# Altium project Bluetooth_BLUE.PrjPCB
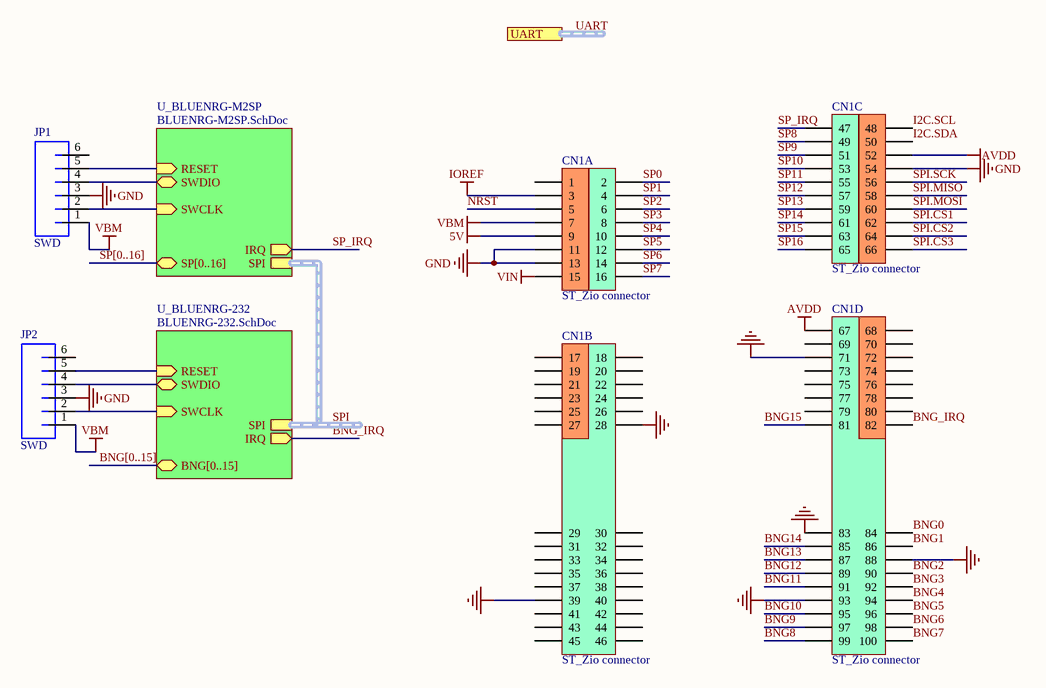
[diagram p0: Bluetooth_BLUE.SchDoc]
4 sheets, 72 parts. Net scope: hierarchical (ports join the sheet entries above them; power ports are global).
Board file: Bluetooth_BLUE.PcbDoc
Sheets:
  Bluetooth_BLUE.SchDoc
    U_BLUENRG-M2SP = BLUENRG-M2SP.SchDoc
    U_BLUENRG-232 = BLUENRG-232.SchDoc
  STM32WB.SchDoc

## Sheet Bluetooth_BLUE.SchDoc
size A4

### Parts
CN1  ST_Zio connector  [ST_Zio]  (parts A,B,C,D of 4)
JP1  SWD  [MOLEX_5045_6]
JP2  SWD  [MOLEX_5045_6]

### Sub-sheets
U_BLUENRG-232 = BLUENRG-232.SchDoc: BNG[0..15] (bidir), IRQ (out), RESET (in), SWCLK (in), SWDIO (bidir), SPI (harness SPI)
U_BLUENRG-M2SP = BLUENRG-M2SP.SchDoc: IRQ (out), RESET (in), SWCLK (in), SWDIO (bidir), SPI (harness SPI), SP[0..16] (bidir)

### Ports
UART (harness USART2)

### Nets
5V: CN1.9
AVDD: CN1.52 CN1.67
GND: CN1.11 CN1.13 CN1.28 CN1.39 CN1.54 CN1.71 CN1.83 CN1.88 CN1.93 JP1.3 JP2.3
IOREF: CN1.3
VBM: CN1.7 JP1.1 JP2.1
VIN: CN1.15
BNG0: CN1.84
BNG1: CN1.86
BNG2: CN1.90
BNG3: CN1.92
BNG4: CN1.94
BNG5: CN1.96
BNG6: CN1.98
BNG7: CN1.82 CN1.100 ; sheet U_BLUENRG-232/IRQ  [also labelled BNG_IRQ]
BNG8: CN1.99
BNG9: CN1.97 JP2.2 ; sheet U_BLUENRG-232/SWCLK
BNG10: CN1.95 JP2.4 ; sheet U_BLUENRG-232/SWDIO
BNG11: CN1.91
BNG12: CN1.89
BNG13: CN1.87
BNG14: CN1.85
BNG15: CN1.81
I2C.SCL: CN1.48
I2C.SDA: CN1.50
NRST: CN1.5
SP0: CN1.2
SP1: CN1.4
SP2: CN1.6
SP3: CN1.8
SP4: CN1.10
SP5: CN1.12
SP6: CN1.14
SP7: CN1.16
SP8: CN1.49
SP9: CN1.51 JP1.2 ; sheet U_BLUENRG-M2SP/SWCLK
SP10: CN1.53 JP1.4 ; sheet U_BLUENRG-M2SP/SWDIO
SP11: CN1.55
SP12: CN1.57
SP13: CN1.59
SP14: CN1.61
SP15: CN1.63
SP16: CN1.65
SP_IRQ: CN1.47 ; sheet U_BLUENRG-M2SP/IRQ
SPI.CS1: CN1.62
SPI.CS2: CN1.64
SPI.CS3: CN1.66
SPI.MISO: CN1.58
SPI.MOSI: CN1.60
SPI.SCK: CN1.56
NetCM2_1: JP1.5 ; sheet U_BLUENRG-M2SP/RESET
NetJP2_5: JP2.5 ; sheet U_BLUENRG-232/RESET

Not connected (* = marked no-connect by the designer): CN1 1 17 18 19 20 21 22 23 24 25 26 27 29 30 31 32 33 34 35 36 37 38 40 41 42 43 44 45 46 68 69 70 72 73 74 75 76 77 78 79 80; JP1 6; JP2 6

### Buses and harness runs
bus BNG[0..15] = sheet U_BLUENRG-232/BNG[0..15]
bus SP[0..16] = sheet U_BLUENRG-M2SP/SP[0..16]
harness SPI = sheet U_BLUENRG-232/SPI = sheet U_BLUENRG-M2SP/SPI
harness UART = port UART

### Library data of the parts
JP1 JP2 = MOLEX_5045_6: PartNumber: B6B-PH-K-S(LF)(SN); Manufacturer: JST Sales America Inc.; PackageReference: JST-PH; Mounting Technology: Through Hole

## Sheet BLUENRG-M2SP.SchDoc
size A4
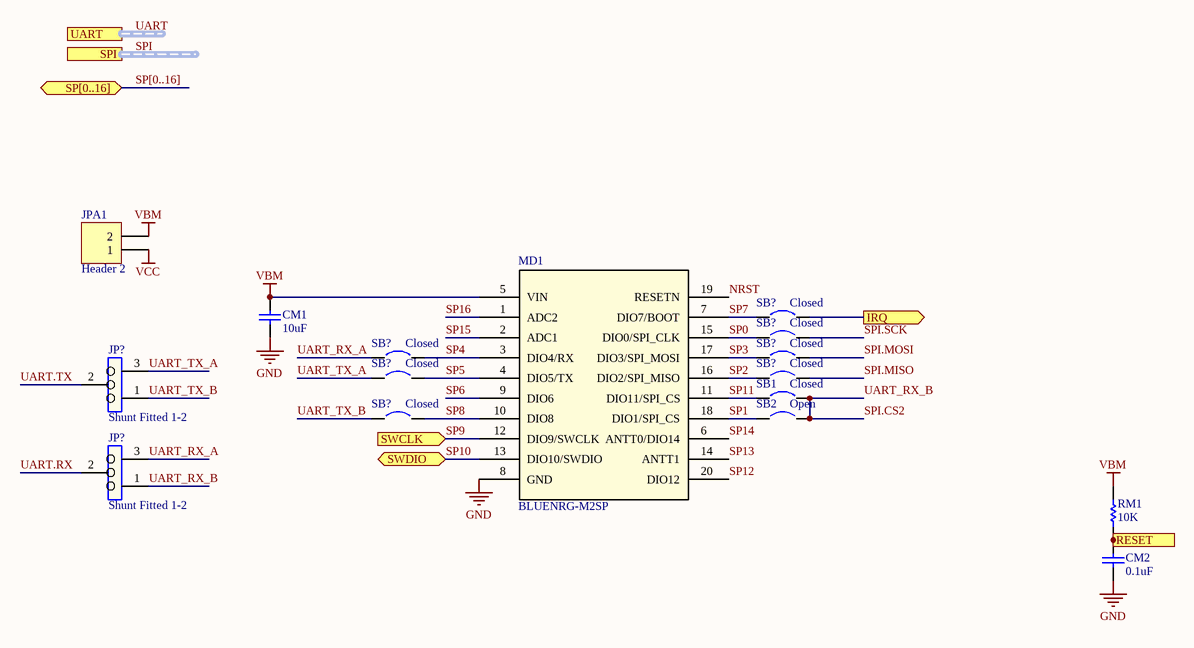
[diagram p1: BLUENRG-M2SP.SchDoc]

### Parts
(Parts that share a designator on the sheet are numbered #1, #2 ... from top to bottom, then left to right.)
CM1  value 10uF  [C0603[1608X92]]  (hidden comment: 10uF 6.3V 0603)
CM2  value 0.1uF  [C0603[1608X92]]  (hidden comment: 0.1uF 16V 0603)
JP?#1  value Shunt Fitted 1-2  [HDR1X3]  (hidden comment: Jumper_Header 3x1 Fitted 1-2)
JP?#2  value Shunt Fitted 1-2  [HDR1X3]  (hidden comment: Jumper_Header 3x1 Fitted 1-2)
JPA1  Header 2  [HDR1X2]
MD1  BLUENRG-M2SP  [BLUENRG-M2SP]
RM1  value 10K  [R0603[1608]]  (hidden comment: 10K 1% 0603)
SB1  Closed  [SB_0603]
SB2  Open  [SB_0603]
SB?#1  Closed  [SB_0603]
SB?#2  Closed  [SB_0603]
SB?#3  Closed  [SB_0603]
SB?#4  Closed  [SB_0603]
SB?#5  Closed  [SB_0603]
SB?#6  Closed  [SB_0603]
SB?#7  Closed  [SB_0603]

### Ports
IRQ (out), RESET (in), SP[0..16] (bidir), SPI (harness SPI), SWCLK (in), SWDIO (bidir), UART (harness USART2)

### Nets
GND: CM1.2 CM2.2 MD1.8(GND)
VBM: CM1.1 JPA1.2 MD1.5(VIN) RM1.2
VCC: JPA1.1
NRST: MD1.19(RESETN)
SP0: MD1.15(DIO0/SPI_CLK) SB?#2.1
SP1: MD1.18(DIO1/SPI_CS) SB2.1
SP2: MD1.16(DIO2/SPI_MISO) SB?#6.1
SP3: MD1.17(DIO3/SPI_MOSI) SB?#4.1
SP4: MD1.3(DIO4/RX) SB?#3.2
SP5: MD1.4(DIO5/TX) SB?#5.2
SP6: MD1.9(DIO6)
SP7: MD1.7(DIO7/BOOT) SB?#1.1
SP8: MD1.10(DIO8) SB?#7.2
SP9: MD1.12(DIO9/SWCLK) ; port SWCLK
SP10: MD1.13(DIO10/SWDIO) ; port SWDIO
SP11: MD1.11(DIO11/SPI_CS) SB1.1
SP12: MD1.20(DIO12)
SP13: MD1.14(ANTT1)
SP14: MD1.6(ANTT0/DIO14)
SP15: MD1.2(ADC1)
SP16: MD1.1(ADC2)
SP_IRQ: SB?#1.2 ; port IRQ
SPI.CS2: JP?#2.1 SB1.2 SB2.2  [also labelled UART_RX_B]
SPI.MISO: SB?#6.2
SPI.MOSI: SB?#4.2
SPI.SCK: SB?#2.2
UART.RX: JP?#2.2
UART.TX: JP?#1.2
UART_RX_A: JP?#2.3 SB?#3.1
UART_TX_A: JP?#1.3 SB?#5.1
UART_TX_B: JP?#1.1 SB?#7.1
NetCM2_1: CM2.1 RM1.1 ; port RESET

### Buses and harness runs
bus SP[0..16] = port SP[0..16]
harness SPI = port SPI
harness UART = port UART

### Library data of the parts
CM1 = CAP_10uF_6.3V_0603_10%: 10uF 6.3V 10% 0603 (1608 Metric); PartNumber: GRM188R60J106KE47D; Manufacturer: Murata; TemperatureCoefficient: X5R; Mounting Technology: Surface Mount; PackageReference: 0603; PackageDescription: 0603 (1608 Metric); Voltage: 6.3V; Tolerance: 10%
CM2 = CAP_0.1uF_16V_0603_10%: 0.1uF 16V 10% 0603 (1608 Metric); PartNumber: GCM188R71C104KA37D; Manufacturer: Murata; TemperatureCoefficient: X7R; Mounting Technology: Surface Mount; PackageReference: 0603; PackageDescription: 0603 (1608 Metric); Voltage: 16V; Tolerance: 10%
JP?#1 JP?#2 = Jumper_Header 3x1 Fitted 1-2: Header, 3x1, 2,54mm, VR, TH, Height 5.84mm/2.54mm - Shunt Fitted 1-2 by default; Internal_Part_Number: MCD-00684; Part_Type: Connector; Manufacturer_Part_Number: TSW-103-07-F-S; Manufacturer: SAMTEC; Provided_By: SUBCO; Status: Released; ComponentLink1Description: Datasheet; ComponentLink1URL: http://tunmcdsvn.tun.st.com/Component_Datasheet_Library/Trunk/Connectors/Samtec_TSW-HTSW-series; ECCN_US: n/a; ECCN_EU: n/a
JPA1 = Header 2: Header, 2-Pin; LatestRevisionDate: 17-Jul-2002; LatestRevisionNote: Re-released for DXP Platform.; Publisher: Altium Limited
MD1 = BLUENRG-M2SP: Manufacturer: STMicroelectronics; PartNumber: BLUENRG-M2SP
RM1 = RES_10K_0603_1%: 10K 0.25W 1% 0603 (1005 Metric); Manufacturer: Vishay / Dale; PartNumber: CRCW060310K0FKEAHP; Tolerance: 1%; Power: 0.25W; Mounting Technology: Surface Mount; PackageReference: 0603; PackageDescription: 0603 (1608 Metric); ComponentLink1Description: Datasheet; ComponentLink1URL: http://www.vishay.com/docs/20065/rcse3.pdf
SB1 SB?#1-SB?#7 = Circuit Breaker_close: Circuit Breaker; Published: 24-Mar-1999; Revision: July-2002: Re-released for DXP Platform.; Publisher: Altium Limited
SB2 = Circuit Breaker: Published: 24-Mar-1999; Revision: July-2002: Re-released for DXP Platform.; Publisher: Altium Limited

## Sheet BLUENRG-232.SchDoc
size A4
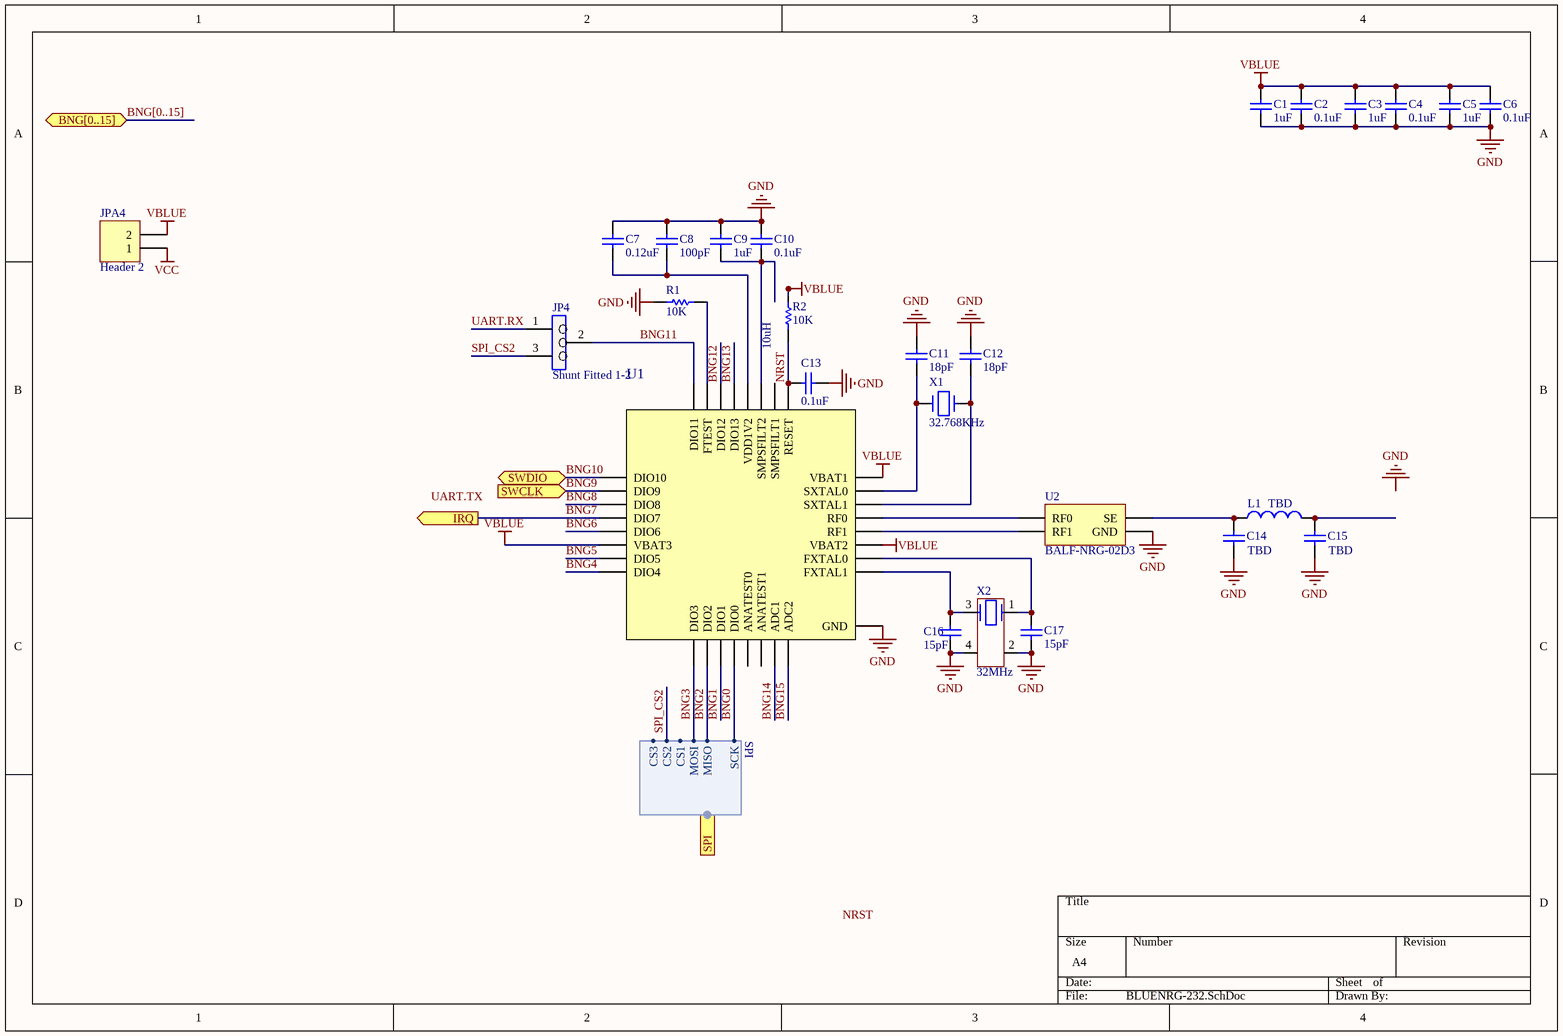
[diagram p2: BLUENRG-232.SchDoc]

### Parts
(Parts that share a designator on the sheet are numbered #1, #2 ... from top to bottom, then left to right.)
C1#1  value 1uF  [C0603[1608X92]]  (hidden comment: 1uF 6.3V 0603)
C2#1  value 0.1uF  [C0603[1608X92]]  (hidden comment: 0.1uF 6.3V 0603)
C3#1  value 1uF  [C0603[1608X92]]  (hidden comment: 1uF 6.3V 0603)
C4#1  value 0.1uF  [C0603[1608X92]]  (hidden comment: 0.1uF 6.3V 0603)
C5#1  value 1uF  [C0603[1608X92]]  (hidden comment: 1uF 6.3V 0603)
C6#1  value 0.1uF  [C0603[1608X92]]  (hidden comment: 0.1uF 6.3V 0603)
C7#1  value 0.12uF  [C0603[1608X92]]  (hidden comment: 0.12uF 10V 0603)
C8#1  value 100pF  [C0603[1608X92]]  (hidden comment: 100pF 10V 0603)
C9#1  value 1uF  [C0603[1608X92]]  (hidden comment: 1uF 6.3V 0603)
C10#1  value 0.1uF  [C0603[1608X92]]  (hidden comment: 0.1uF 6.3V 0603)
C11#1  value 18pF  [C0603[1608X92]]  (hidden comment: 18pF 50V 0603)
C12#1  value 18pF  [C0603[1608X92]]  (hidden comment: 18pF 50V 0603)
C13#1  value 0.1uF  [C0603[1608X92]]  (hidden comment: 0.1uF 16V 0603)
C14#1  CAPACITOR 0603  [C0603[1608X92]]  (value not drawn)
C15#1  CAPACITOR 0603  [C0603[1608X92]]  (value not drawn)
C16#1  value 15pF  [C0603[1608X92]]  (hidden comment: 15pF 50V 0603)
C17#1  value 15pF  [C0603[1608X92]]  (hidden comment: 15pF 50V 0603)
JP4#1  value Shunt Fitted 1-2  [HDR1X3]  (hidden comment: Jumper_Header 3x1 Fitted 1-2)
JPA4#1  Header 2  [HDR1X2]
L1#1  INDUCTOR 0603  [IND0603]  (value not drawn)
R1#1  value 10K  [R0603[1608]]  (hidden comment: 10K 1% 0603)
R2#1  value 10K  [R0603[1608]]  (hidden comment: 10K 1% 0603)
U1  BLUENRG-232  [QFPN-32-5x5mm]  (value not drawn)
U2#1  BALF-NRG-02D3  [CSPG-4 (0.4mm)]
X1#1  value 32.768KHz  [2-SMD]  (hidden comment: NX3215SA 32.768KHz)
X2#1  value 32MHz  [4-SMD]  (hidden comment: NX2016SA 32MHz)

### Ports
BNG[0..15] (bidir), IRQ (out), SPI (harness SPI), SWCLK (in), SWDIO (bidir)

### Harnesses
SPI: MOSI, MISO, SCK, CS1, CS2, CS3

### Nets
GND: C1#1.1 C2#1.1 C3#1.1 C4#1.1 C5#1.1 C6#1.1 C7#1.2 C8#1.2 C9#1.2 C10#1.2 C11#1.2 C12#1.2 C13#1.2 C14#1.1 C15#1.1 C16#1.1 C17#1.1 R1#1.2 U1.33(GND) U2#1.A2(GND) X2#1.2 X2#1.4
VBLUE: C1#1.2 C2#1.2 C3#1.2 C4#1.2 C5#1.2 C6#1.2 JPA4#1.2 R2#1.2 U1.6(VBAT3) U1.19(VBAT2) U1.24(VBAT1)
VCC: JPA4#1.1
BNG0: U1.12(DIO0) ; port SPI.SCK
BNG1: U1.11(DIO1)
BNG2: U1.10(DIO2) ; port SPI.MISO
BNG3: U1.9(DIO3) ; port SPI.MOSI
BNG4: U1.8(DIO4)
BNG5: U1.7(DIO5)
BNG6: U1.5(DIO6)
BNG7: U1.4(DIO7) ; port IRQ
BNG8: U1.3(DIO8)
BNG9: U1.2(DIO9) ; port SWCLK
BNG10: U1.1(DIO10) ; port SWDIO
BNG11: JP4#1.2 U1.32(DIO11)
BNG12: U1.30(DIO12)
BNG13: U1.29(DIO13)
BNG14: U1.15(ADC1)
BNG15: U1.16(ADC2)
NRST: C13#1.1 R2#1.1 U1.25(RESET)
SPI_CS2: JP4#1.3 ; port SPI.CS2  [project net SPI.CS2]
UART.RX: JP4#1.1
NetC7#1_1: C7#1.1 C8#1.1 U1.28(VDD1V2)
NetC9#1_1: C9#1.1 C10#1.1 U1.27(SMPSFILT2)
NetC11#1_1: C11#1.1 U1.23(SXTAL0) X1#1.1(X1)
NetC12#1_1: C12#1.1 U1.22(SXTAL1) X1#1.2(X2)
NetC14#1_2: C14#1.2 L1#1.1 U2#1.A1(SE)
NetC15#1_2: C15#1.2 L1#1.2
NetC16#1_2: C16#1.2 U1.17(FXTAL1) X2#1.3
NetC17#1_2: C17#1.2 U1.18(FXTAL0) X2#1.1
NetR1#1_1: R1#1.1 U1.31(FTEST)
NetU1_20: U1.20(RF1) U2#1.B2(RF1)
NetU1_21: U1.21(RF0) U2#1.B1(RF0)

Not connected (* = marked no-connect by the designer): U1 13(ANATEST0) 14(ANATEST1) 26(SMPSFILT1)

### Buses and harness runs
bus BNG[0..15] = port BNG[0..15]

### Notes on the sheet
- (near R2#1) 10uH
- (near L1#1) TBD
- (near C14#1) TBD
- (near C15#1) TBD
- Labels drawn without touching a wire or pin: GND, NRST, UART.TX

### Library data of the parts
C1#1 C3#1 C5#1 C9#1 = CAP_1uF_6.3V_0603_10%: 1uF 6.3V 10% 0603 (1608 Metric); PartNumber: GRM188R60J105KA01D; Manufacturer: Murata; TemperatureCoefficient: X5R; Mounting Technology: Surface Mount; PackageReference: 0603; PackageDescription: 0603 (1608 Metric); Voltage: 6.3V; Tolerance: 10%
C2#1 C4#1 C6#1 C10#1 = CAP_0.1uF_6.3V_0603_10%: 0.1uF 6.3V 10% 0603 (1608 Metric); PartNumber: GRM188R70J104KA01D; Manufacturer: Murata; Mounting Technology: Surface Mount; PackageReference: 0603; PackageDescription: 0603 (1608 Metric); Voltage: 6.3V; Tolerance: 10%
C7#1 = CAP_0.12uF_10V_0603_10%: 0.12uF 10V 10% 0603 (1608 Metric); PartNumber: GRM188R71A124KA01D; Manufacturer: Murata; TemperatureCoefficient: X7R; Mounting Technology: Surface Mount; PackageReference: 0603; PackageDescription: 0603 (1608 Metric); Voltage: 10V; Tolerance: 10%
C8#1 = CAP_100pF_10V_0603_10%: 100pF 10V 10% 0603 (1608 Metric); PartNumber: 885012206003; Manufacturer: Wurth; TemperatureCoefficient: X7R; Mounting Technology: Surface Mount; PackageReference: 0603; PackageDescription: 0603 (1608 Metric); Voltage: 10V; Tolerance: 10%
C11#1 C12#1 = CAP_18pF_50V_0603_1%: 18pF 50V 1% 0603 (1608 Metric); PartNumber: 06035A180FAT2A; Manufacturer: AVX Corporation; TemperatureCoefficient: C0G; Mounting Technology: Surface Mount; PackageReference: 0603; PackageDescription: 0603 (1608 Metric); Voltage: 50V; Tolerance: 1%
C13#1 = CAP_0.1uF_16V_0603_10%: as CM2 on sheet BLUENRG-M2SP; Mounting Technology: Surface Mount; PackageReference: 0603; PackageDescription: 0603 (1608 Metric); Voltage: 16V; Tolerance: 10%
C14#1 C15#1 = CAP 0603: Empty CAPACITOR 0603 (1608 Metric); Mounting Technology: Surface Mount; PackageReference: 0603; PackageDescription: 0603 (1608 Metric)
C16#1 C17#1 = CAP_15pF_50V_0603_1%: 15pF 50V 1% 0603 (1608 Metric); PartNumber: 06035A150FAT2A; Manufacturer: AVX Corporation; TemperatureCoefficient: C0G; Mounting Technology: Surface Mount; PackageReference: 0603; PackageDescription: 0603 (1608 Metric); Voltage: 50V; Tolerance: 1%
JP4#1 = Jumper_Header 3x1 Fitted 1-2: as JP?#1 on sheet BLUENRG-M2SP; Status: Released; ComponentLink1Description: Datasheet; ComponentLink1URL: http://tunmcdsvn.tun.st.com/Component_Datasheet_Library/Trunk/Connectors/Samtec_TSW-HTSW-series; ECCN_US: n/a; ECCN_EU: n/a
JPA4#1 = Header 2: Header, 2-Pin; LatestRevisionDate: 17-Jul-2002; LatestRevisionNote: Re-released for DXP Platform.; Publisher: Altium Limited
L1#1 = IND 0603: Empty INDUCTOR 0603; PackageReference: 0603; PackageDescription: 0603 (1608 metric); Mounting Technology: Surface Mount
R1#1 R2#1 = RES_10K_0603_1%: as RM1 on sheet BLUENRG-M2SP; Tolerance: 1%; Power: 0.25W; Mounting Technology: Surface Mount; PackageReference: 0603; PackageDescription: 0603 (1608 Metric); ComponentLink1Description: Datasheet; ComponentLink1URL: http://www.vishay.com/docs/20065/rcse3.pdf
U1 = BLUENRG-232: Manufacturer: STMicroelectronics; Part Number: BLUENRG-232; PackageReference: QFN-32; Mounting Technology: Surface Mount
U2#1 = BALF-NRG-02D3: 50 ohm nominal input / conjugate match to BlueNRG tranceiver; Manufacturer: STMicroelectronics; PartNumber: BALF-NRG-02D3; PackageReference: CSPG-4; Mounting Technology: Surface Mount
X1#1 = NX3215SA 32.768KHz: Crystal 32.768kHz, 6pF, +-20ppm, 50Kohms max, SMD; PartNumber: NX3215SA-32.768KHz-EXS00A-MU00525; Manufacturer: NDK; Mounting Technology: Surface Mount; PackageReference: 2-SMD; Type: Crystal_Osc
X2#1 = NX2016SA 32MHz: Crystal 32MHz, 6pF, +-10ppm, 60ohms max, SMD; PartNumber: NX2016SA-32MHZ-EXS00A-CS07977; Manufacturer: NDK; Mounting Technology: Surface Mount; PackageReference: 4-SMD; Type: Crystal_Osc

## Sheet STM32WB.SchDoc
size A4
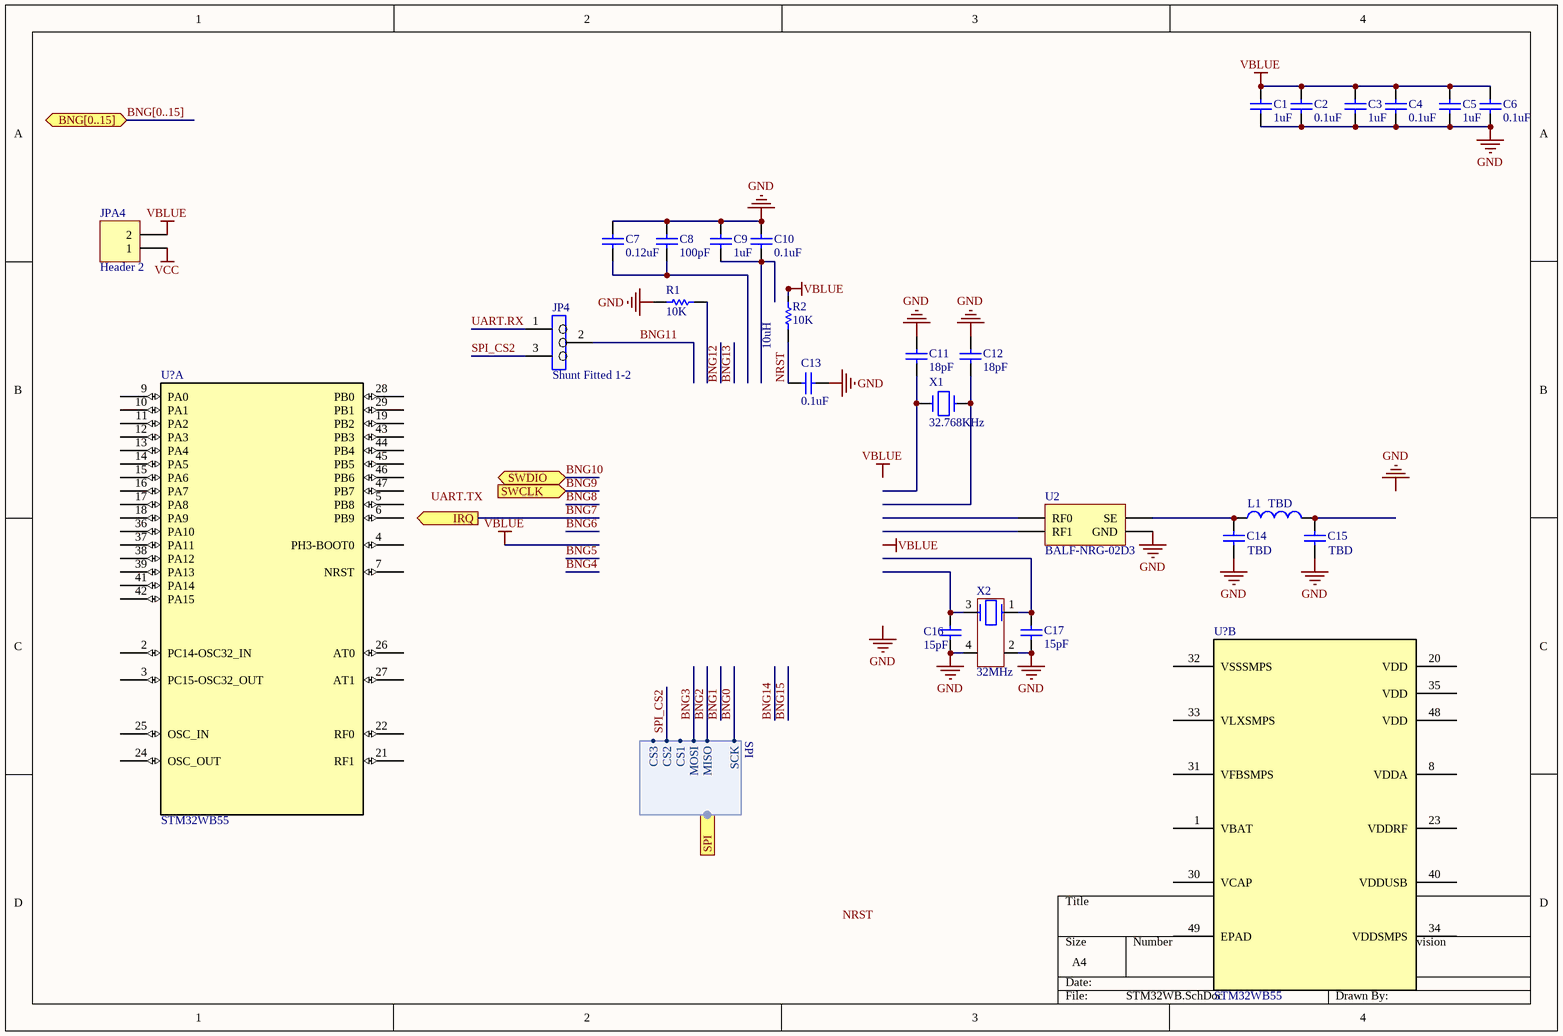
[diagram p3: STM32WB.SchDoc]

### Parts
(Parts that share a designator on the sheet are numbered #1, #2 ... from top to bottom, then left to right.)
C1#2  value 1uF  [C0603[1608X92]]  (hidden comment: 1uF 6.3V 0603)
C2#2  value 0.1uF  [C0603[1608X92]]  (hidden comment: 0.1uF 6.3V 0603)
C3#2  value 1uF  [C0603[1608X92]]  (hidden comment: 1uF 6.3V 0603)
C4#2  value 0.1uF  [C0603[1608X92]]  (hidden comment: 0.1uF 6.3V 0603)
C5#2  value 1uF  [C0603[1608X92]]  (hidden comment: 1uF 6.3V 0603)
C6#2  value 0.1uF  [C0603[1608X92]]  (hidden comment: 0.1uF 6.3V 0603)
C7#2  value 0.12uF  [C0603[1608X92]]  (hidden comment: 0.12uF 10V 0603)
C8#2  value 100pF  [C0603[1608X92]]  (hidden comment: 100pF 10V 0603)
C9#2  value 1uF  [C0603[1608X92]]  (hidden comment: 1uF 6.3V 0603)
C10#2  value 0.1uF  [C0603[1608X92]]  (hidden comment: 0.1uF 6.3V 0603)
C11#2  value 18pF  [C0603[1608X92]]  (hidden comment: 18pF 50V 0603)
C12#2  value 18pF  [C0603[1608X92]]  (hidden comment: 18pF 50V 0603)
C13#2  value 0.1uF  [C0603[1608X92]]  (hidden comment: 0.1uF 16V 0603)
C14#2  CAPACITOR 0603  [C0603[1608X92]]  (value not drawn)
C15#2  CAPACITOR 0603  [C0603[1608X92]]  (value not drawn)
C16#2  value 15pF  [C0603[1608X92]]  (hidden comment: 15pF 50V 0603)
C17#2  value 15pF  [C0603[1608X92]]  (hidden comment: 15pF 50V 0603)
JP4#2  value Shunt Fitted 1-2  [HDR1X3]  (hidden comment: Jumper_Header 3x1 Fitted 1-2)
JPA4#2  Header 2  [HDR1X2]
L1#2  INDUCTOR 0603  [IND0603]  (value not drawn)
R1#2  value 10K  [R0603[1608]]  (hidden comment: 10K 1% 0603)
R2#2  value 10K  [R0603[1608]]  (hidden comment: 10K 1% 0603)
U2#2  BALF-NRG-02D3  [CSPG-4 (0.4mm)]
U?#1  STM32WB55  [UFQFPN-48_7X7X0P]  (part A of 2)
U?#2  STM32WB55  [UFQFPN-48_7X7X0P]  (part B of 2)
X1#2  value 32.768KHz  [2-SMD]  (hidden comment: NX3215SA 32.768KHz)
X2#2  value 32MHz  [4-SMD]  (hidden comment: NX2016SA 32MHz)

### Ports
BNG[0..15] (bidir), IRQ (out), SPI (harness SPI), SWCLK (in), SWDIO (bidir)

### Harnesses
SPI: MOSI, MISO, SCK, CS1, CS2, CS3

### Nets
GND: C1#2.1 C2#2.1 C3#2.1 C4#2.1 C5#2.1 C6#2.1 C7#2.2 C8#2.2 C9#2.2 C10#2.2 C11#2.2 C12#2.2 C13#2.2 C14#2.1 C15#2.1 C16#2.1 C17#2.1 R1#2.2 U2#2.A2(GND) X2#2.2 X2#2.4
VBLUE: C1#2.2 C2#2.2 C3#2.2 C4#2.2 C5#2.2 C6#2.2 JPA4#2.2 R2#2.2
VCC: JPA4#2.1
BNG0: port SPI.SCK
BNG2: port SPI.MISO
BNG3: port SPI.MOSI
BNG7: port IRQ
BNG9: port SWCLK
BNG10: port SWDIO
BNG11: JP4#2.2
NRST: C13#2.1 R2#2.1
SPI_CS2: JP4#2.3 ; port SPI.CS2
UART.RX: JP4#2.1
NetC7#2_1: C7#2.1 C8#2.1
NetC9#2_1: C9#2.1 C10#2.1
NetC11#2_1: C11#2.1 X1#2.1(X1)
NetC12#2_1: C12#2.1 X1#2.2(X2)
NetC14#2_2: C14#2.2 L1#2.1 U2#2.A1(SE)
NetC15#2_2: C15#2.2 L1#2.2
NetC16#2_2: C16#2.2 X2#2.3
NetC17#2_2: C17#2.2 X2#2.1

Not connected (* = marked no-connect by the designer): R1#2 1; U2#2 B1(RF0) B2(RF1); U?#1 2(PC14-OSC32_IN) 3(PC15-OSC32_OUT) 4(PH3-BOOT0) 5(PB8) 6(PB9) 7(NRST) 9(PA0) 10(PA1) 11(PA2) 12(PA3) 13(PA4) 14(PA5) 15(PA6) 16(PA7) 17(PA8) 18(PA9) 19(PB2) 21(RF1) 22(RF0) 24(OSC_OUT) 25(OSC_IN) 26(AT0) 27(AT1) 28(PB0) 29(PB1) 36(PA10) 37(PA11) 38(PA12) 39(PA13) 41(PA14) 42(PA15) 43(PB3) 44(PB4) 45(PB5) 46(PB6) 47(PB7); U?#2 1(VBAT) 8(VDDA) 20(VDD) 23(VDDRF) 30(VCAP) 31(VFBSMPS) 32(VSSSMPS) 33(VLXSMPS) 34(VDDSMPS) 35(VDD) 40(VDDUSB) 48(VDD) 49(EPAD)

### Buses and harness runs
bus BNG[0..15] = port BNG[0..15]

### Notes on the sheet
- (near R2#2) 10uH
- (near L1#2) TBD
- (near C14#2) TBD
- (near C15#2) TBD
- Labels drawn without touching a wire or pin: GND, NRST, UART.TX, VBLUE

### Library data of the parts
C1#2 C3#2 C5#2 C9#2 = CAP_1uF_6.3V_0603_10%: as C1#1 on sheet BLUENRG-232; Mounting Technology: Surface Mount; PackageReference: 0603; PackageDescription: 0603 (1608 Metric); Voltage: 6.3V; Tolerance: 10%
C2#2 C4#2 C6#2 C10#2 = CAP_0.1uF_6.3V_0603_10%: as C2#1 on sheet BLUENRG-232; Mounting Technology: Surface Mount; PackageReference: 0603; PackageDescription: 0603 (1608 Metric); Voltage: 6.3V; Tolerance: 10%
C7#2 = CAP_0.12uF_10V_0603_10%: as C7#1 on sheet BLUENRG-232; Mounting Technology: Surface Mount; PackageReference: 0603; PackageDescription: 0603 (1608 Metric); Voltage: 10V; Tolerance: 10%
C8#2 = CAP_100pF_10V_0603_10%: as C8#1 on sheet BLUENRG-232; Mounting Technology: Surface Mount; PackageReference: 0603; PackageDescription: 0603 (1608 Metric); Voltage: 10V; Tolerance: 10%
C11#2 C12#2 = CAP_18pF_50V_0603_1%: as C11#1 on sheet BLUENRG-232; Mounting Technology: Surface Mount; PackageReference: 0603; PackageDescription: 0603 (1608 Metric); Voltage: 50V; Tolerance: 1%
C13#2 = CAP_0.1uF_16V_0603_10%: as CM2 on sheet BLUENRG-M2SP; Mounting Technology: Surface Mount; PackageReference: 0603; PackageDescription: 0603 (1608 Metric); Voltage: 16V; Tolerance: 10%
C14#2 C15#2 = CAP 0603: Empty CAPACITOR 0603 (1608 Metric); Mounting Technology: Surface Mount; PackageReference: 0603; PackageDescription: 0603 (1608 Metric)
C16#2 C17#2 = CAP_15pF_50V_0603_1%: as C16#1 on sheet BLUENRG-232; Mounting Technology: Surface Mount; PackageReference: 0603; PackageDescription: 0603 (1608 Metric); Voltage: 50V; Tolerance: 1%
JP4#2 = Jumper_Header 3x1 Fitted 1-2: as JP?#1 on sheet BLUENRG-M2SP; Status: Released; ComponentLink1Description: Datasheet; ComponentLink1URL: http://tunmcdsvn.tun.st.com/Component_Datasheet_Library/Trunk/Connectors/Samtec_TSW-HTSW-series; ECCN_US: n/a; ECCN_EU: n/a
JPA4#2 = Header 2: Header, 2-Pin; LatestRevisionDate: 17-Jul-2002; LatestRevisionNote: Re-released for DXP Platform.; Publisher: Altium Limited
L1#2 = IND 0603: Empty INDUCTOR 0603; PackageReference: 0603; PackageDescription: 0603 (1608 metric); Mounting Technology: Surface Mount
R1#2 R2#2 = RES_10K_0603_1%: as RM1 on sheet BLUENRG-M2SP; Tolerance: 1%; Power: 0.25W; Mounting Technology: Surface Mount; PackageReference: 0603; PackageDescription: 0603 (1608 Metric); ComponentLink1Description: Datasheet; ComponentLink1URL: http://www.vishay.com/docs/20065/rcse3.pdf
U2#2 = BALF-NRG-02D3: as U2#1 on sheet BLUENRG-232; PartNumber: BALF-NRG-02D3; PackageReference: CSPG-4; Mounting Technology: Surface Mount
U?#1 U?#2 = STM32WB_UFQFPN48: Multiprotocol wireless 32-bit MCU Arm®-based Cortex®-M4 with FPU, Bluetooth® 5 and 802.15.4 radio solution; Manufacturer: STMicroelectronics; Copyright: Copyright (C) 2016 Accelerated Designs. All rights reserved; PartNumber: STM32WB55; Mounting Technology: Surface Mount; PackageReference: UFQFPN-48
X1#2 = NX3215SA 32.768KHz: as X1#1 on sheet BLUENRG-232; Mounting Technology: Surface Mount; PackageReference: 2-SMD; Type: Crystal_Osc
X2#2 = NX2016SA 32MHz: as X2#1 on sheet BLUENRG-232; Mounting Technology: Surface Mount; PackageReference: 4-SMD; Type: Crystal_Osc

## Nets that join several sheets
GND: Bluetooth_BLUE (11 pins), BLUENRG-M2SP (CM1.2 CM2.2 MD1.8), BLUENRG-232 (22 pins), STM32WB (21 pins)
VBLUE: BLUENRG-232 (11 pins), STM32WB (8 pins)
VBM: Bluetooth_BLUE (CN1.7 JP1.1 JP2.1), BLUENRG-M2SP (CM1.1 JPA1.2 MD1.5 RM1.2)
VCC: BLUENRG-M2SP (JPA1.1), BLUENRG-232 (JPA4#1.1), STM32WB (JPA4#2.1)
BNG0: Bluetooth_BLUE (CN1.84), BLUENRG-232 (U1.12)
BNG1: Bluetooth_BLUE (CN1.86), BLUENRG-232 (U1.11)
BNG2: Bluetooth_BLUE (CN1.90), BLUENRG-232 (U1.10)
BNG3: Bluetooth_BLUE (CN1.92), BLUENRG-232 (U1.9)
BNG4: Bluetooth_BLUE (CN1.94), BLUENRG-232 (U1.8)
BNG5: Bluetooth_BLUE (CN1.96), BLUENRG-232 (U1.7)
BNG6: Bluetooth_BLUE (CN1.98), BLUENRG-232 (U1.5)
BNG7: Bluetooth_BLUE (CN1.82 CN1.100), BLUENRG-232 (U1.4)
BNG8: Bluetooth_BLUE (CN1.99), BLUENRG-232 (U1.3)
BNG9: Bluetooth_BLUE (CN1.97 JP2.2), BLUENRG-232 (U1.2)
BNG10: Bluetooth_BLUE (CN1.95 JP2.4), BLUENRG-232 (U1.1)
BNG11: Bluetooth_BLUE (CN1.91), BLUENRG-232 (JP4#1.2 U1.32)
BNG12: Bluetooth_BLUE (CN1.89), BLUENRG-232 (U1.30)
BNG13: Bluetooth_BLUE (CN1.87), BLUENRG-232 (U1.29)
BNG14: Bluetooth_BLUE (CN1.85), BLUENRG-232 (U1.15)
BNG15: Bluetooth_BLUE (CN1.81), BLUENRG-232 (U1.16)
NetCM2_1: Bluetooth_BLUE (JP1.5), BLUENRG-M2SP (CM2.1 RM1.1)
SP0: Bluetooth_BLUE (CN1.2), BLUENRG-M2SP (MD1.15 SB?#2.1)
SP1: Bluetooth_BLUE (CN1.4), BLUENRG-M2SP (MD1.18 SB2.1)
SP2: Bluetooth_BLUE (CN1.6), BLUENRG-M2SP (MD1.16 SB?#6.1)
SP3: Bluetooth_BLUE (CN1.8), BLUENRG-M2SP (MD1.17 SB?#4.1)
SP4: Bluetooth_BLUE (CN1.10), BLUENRG-M2SP (MD1.3 SB?#3.2)
SP5: Bluetooth_BLUE (CN1.12), BLUENRG-M2SP (MD1.4 SB?#5.2)
SP6: Bluetooth_BLUE (CN1.14), BLUENRG-M2SP (MD1.9)
SP7: Bluetooth_BLUE (CN1.16), BLUENRG-M2SP (MD1.7 SB?#1.1)
SP8: Bluetooth_BLUE (CN1.49), BLUENRG-M2SP (MD1.10 SB?#7.2)
SP9: Bluetooth_BLUE (CN1.51 JP1.2), BLUENRG-M2SP (MD1.12)
SP10: Bluetooth_BLUE (CN1.53 JP1.4), BLUENRG-M2SP (MD1.13)
SP11: Bluetooth_BLUE (CN1.55), BLUENRG-M2SP (MD1.11 SB1.1)
SP12: Bluetooth_BLUE (CN1.57), BLUENRG-M2SP (MD1.20)
SP13: Bluetooth_BLUE (CN1.59), BLUENRG-M2SP (MD1.14)
SP14: Bluetooth_BLUE (CN1.61), BLUENRG-M2SP (MD1.6)
SP15: Bluetooth_BLUE (CN1.63), BLUENRG-M2SP (MD1.2)
SP16: Bluetooth_BLUE (CN1.65), BLUENRG-M2SP (MD1.1)
SP_IRQ: Bluetooth_BLUE (CN1.47), BLUENRG-M2SP (SB?#1.2)